# Altium schematic sheet ESP32-1-System.SchDoc
size A
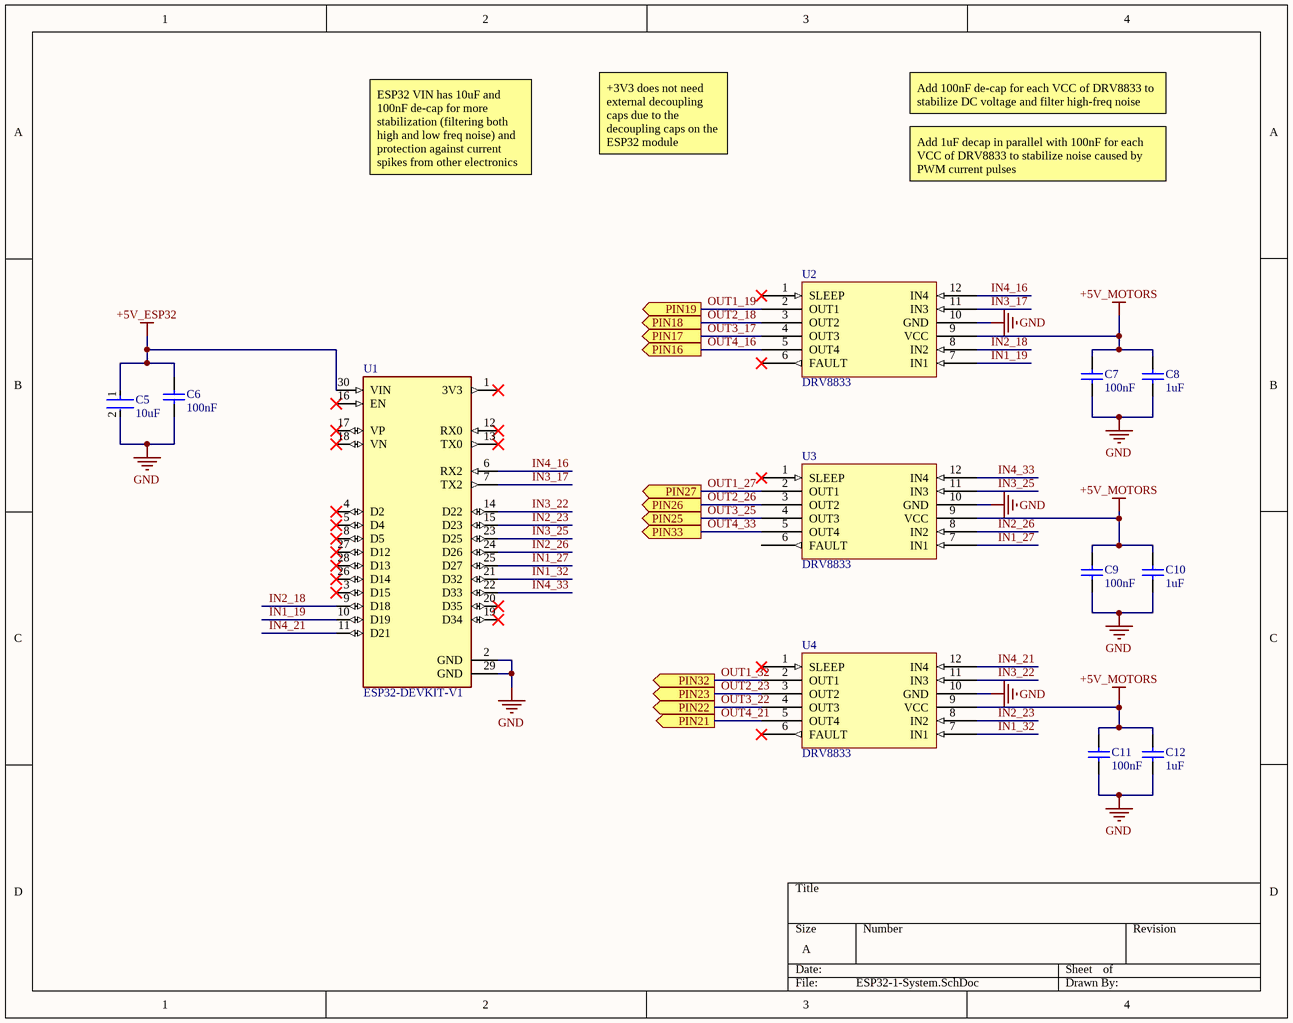
[diagram p0: ESP32-1-System.SchDoc]

## Parts
C5  10uF  [FP-GCJ31C-0_4-IPC_C]
C6  100nF  [CAPC1206(3216)170_L]
C7  100nF  [CAPC1206(3216)170_L]
C8  1uF  [CAPC1206(3216)170_L]
C9  100nF  [CAPC1206(3216)170_L]
C10  1uF  [CAPC1206(3216)170_L]
C11  100nF  [CAPC1206(3216)170_L]
C12  1uF  [CAPC1206(3216)170_L]
U1  ESP32-DEVKIT-V1  [MODULE_ESP32_DEVKIT_V1]
U2  DRV8833  [PCBComponent_1]
U3  DRV8833  [PCBComponent_1]
U4  DRV8833  [PCBComponent_1]

## Ports
PIN16 (out), PIN17 (out), PIN18 (out), PIN19 (out), PIN21 (out), PIN22 (out), PIN23 (out), PIN25 (out), PIN26 (out), PIN27 (out), PIN32 (out), PIN33 (out)

## Nets
+5V_ESP32: C5.1 C6.2 U1.30(VIN)
+5V_MOTORS: C7.2 C8.2 C9.2 C10.2 C11.2 C12.2 U2.9(VCC) U3.9(VCC) U4.9(VCC)
GND: C5.2 C6.1 C7.1 C8.1 C9.1 C10.1 C11.1 C12.1 U1.2(GND) U1.29(GND) U2.10(GND) U3.10(GND) U4.10(GND)
IN1_19: U1.10(D19) U2.7(IN1)
IN1_27: U1.25(D27) U3.7(IN1)
IN1_32: U1.21(D32) U4.7(IN1)
IN2_18: U1.9(D18) U2.8(IN2)
IN2_23: U1.15(D23) U4.8(IN2)
IN2_26: U1.24(D26) U3.8(IN2)
IN3_17: U1.7(TX2) U2.11(IN3)
IN3_22: U1.14(D22) U4.11(IN3)
IN3_25: U1.23(D25) U3.11(IN3)
IN4_16: U1.6(RX2) U2.12(IN4)
IN4_21: U1.11(D21) U4.12(IN4)
IN4_33: U1.22(D33) U3.12(IN4)
OUT1_19: U2.2(OUT1) ; port PIN19
OUT1_27: U3.2(OUT1) ; port PIN27
OUT1_32: U4.2(OUT1) ; port PIN32
OUT2_18: U2.3(OUT2) ; port PIN18
OUT2_23: U4.3(OUT2) ; port PIN23
OUT2_26: U3.3(OUT2) ; port PIN26
OUT3_17: U2.4(OUT3) ; port PIN17
OUT3_22: U4.4(OUT3) ; port PIN22
OUT3_25: U3.4(OUT3) ; port PIN25
OUT4_16: U2.5(OUT4) ; port PIN16
OUT4_21: U4.5(OUT4) ; port PIN21
OUT4_33: U3.5(OUT4) ; port PIN33

Not connected (* = marked no-connect by the designer): U1 1(3V3)* 3(D15)* 4(D2)* 5(D4)* 8(D5)* 12(RX0)* 13(TX0)* 16(EN)* 17(VP)* 18(VN)* 19(D34)* 20(D35)* 26(D14)* 27(D12)* 28(D13)*; U2 1(SLEEP)* 6(FAULT)*; U3 1(SLEEP)* 6(FAULT); U4 1(SLEEP)* 6(FAULT)*

## Notes on the sheet
- +3V3 does not need external decoupling caps due to the decoupling caps on the ESP32 module
- Add 100nF de-cap for each VCC of DRV8833 to stabilize DC voltage and filter high-freq noise
- ESP32 VIN has 10uF and 100nF de-cap for more stabilization (filtering both high and low freq noise) and protection against current spikes from other electronics
- Add 1uF decap in parallel with 100nF for each VCC of DRV8833 to stabilize noise caused by PWM current pulses

## Library data of the parts
C5 = CMP-06035-004889-1: Cap Ceramic 10uF 35V X7T 10% SMD 1206 +125°C Embossed Plastic T/R
C6 C7 C9 C11 = CMP-1037-04201-1: CAP 100nF 50V ±10% 1206 (3216 Metric) Thickness 1.7mm SMD; Case-Metric: 3216; Tolerance: Â±10%; Case-EIA: 1206; Value: 100nF; Max Thickness: 1.7 mm; Rated Voltage: 50 V; Technology: SMT
C8 C10 C12 = CMP-1037-04687-1: CAP 1uF 16V ±10% 1206 (3216 Metric) Thickness 1.7mm SMD; Case-EIA: 1206; Tolerance: Â±10%; Case-Metric: 3216; Rated Voltage: 16 V; Max Thickness: 1.7 mm; Technology: SMT; Value: 1uF
U1 = CMP-008-000000-1: Dual core, Wi-Fi: 2.4 GHz up to 150 Mbits/s,BLE (Bluetooth Low Energy) and legacy Bluetooth, 32 bits, Up to 240 MHz; MF: Do it; Value: *; SnapEDA_Link: https://www.snapeda.com/parts/ESP32-DEVKIT-V1/Do+it/view-part/?ref=snap; MP: ESP32-DEVKIT-V1; Design Item ID: ESP32-DEVKIT-V1; Package: None; Check_prices: https://www.snapeda.com/parts/ESP32-DEVKIT-V1/Do+it/view-part/?ref=eda; Pin Count: 30; Component Type: Standard; Source: ESP32-DEVKIT-V1.SchLib
U2-U4 = DRV8833: 1.5A 2-Channel DC Motor Drive Board Ultra Small Volume Motor Drive Module Input Voltage 3 to 10V